# Altium project Carte_OPB.PrjPcb
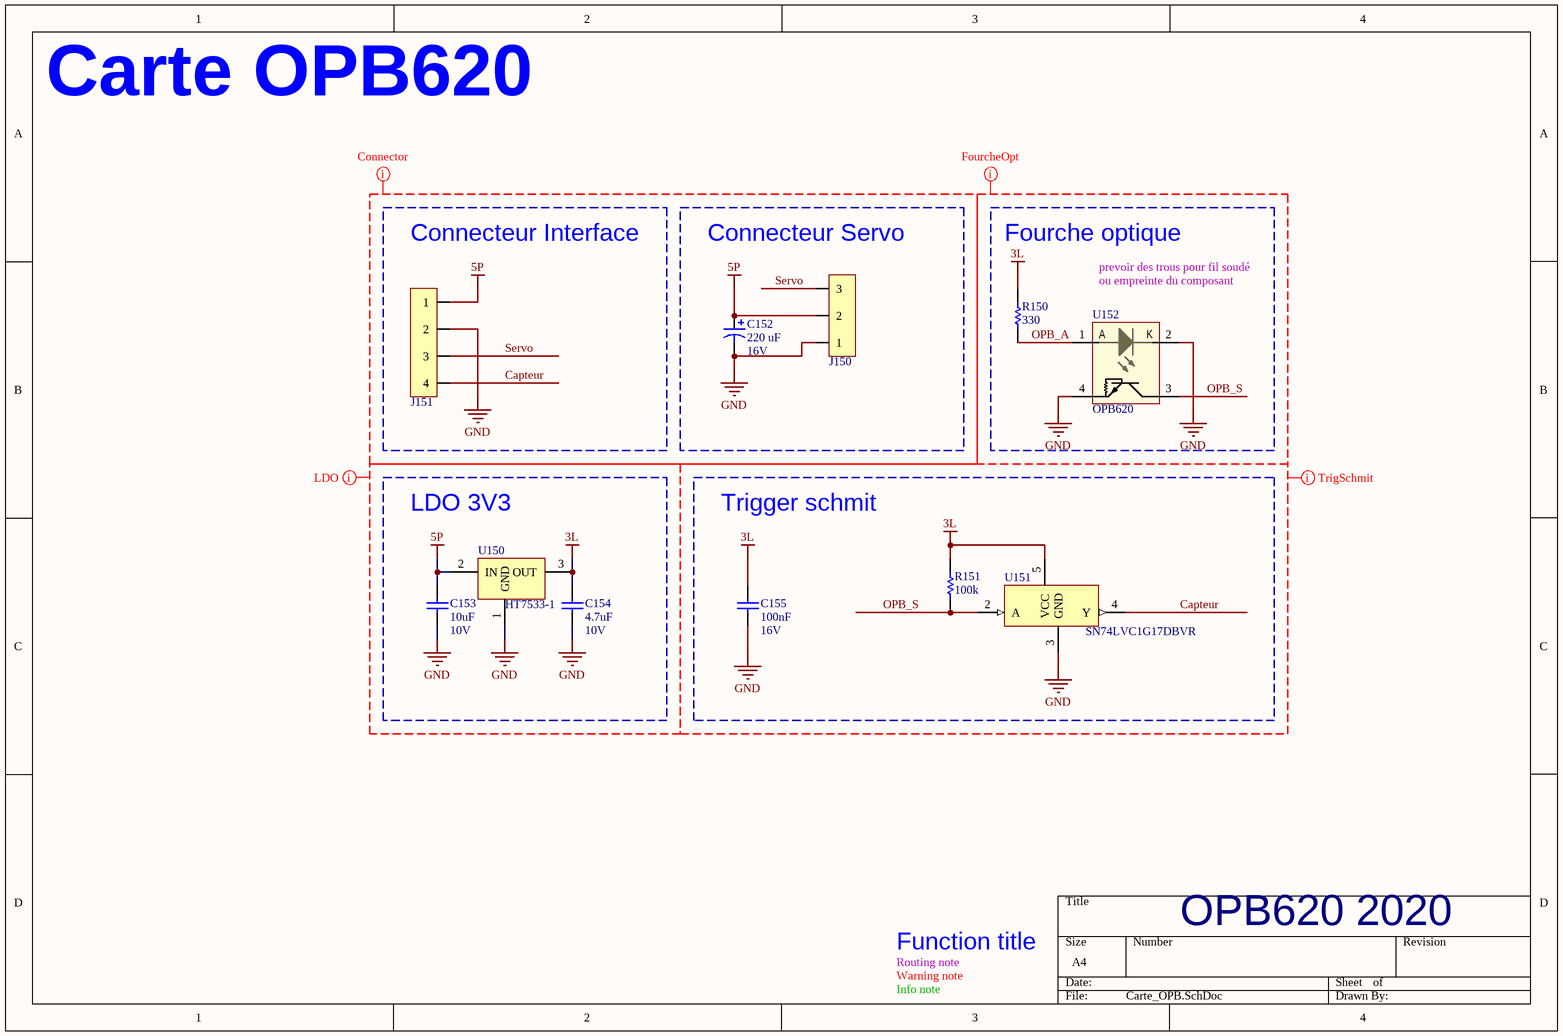
[diagram p0: Carte_OPB.SchDoc]
1 sheet, 11 parts. Net scope: global (net labels, ports and power ports of the same name join across sheets).
Board file: Carte_OPB-4L.PcbDoc

## Sheet Carte_OPB.SchDoc
size A4; Author: Audran; CompanyName: Goldorak; Address1: Electrolab; Address2: 52 rue Paul Lescop; Address3: 92000 Nanterre; DocumentNumber: 1; SheetNumber: 1; SheetTotal: 5; ProjectName: Cartes_2017

### Parts
C152  220 uF  RatedVoltage: 16V  [WCAP-ATG8_6.3x11x2.5x0.5]
C153  10uF  RatedVoltage: 10V  [WCAP-CSGP_0805, 2x1.25x1.25]
C154  4.7uF  RatedVoltage: 10V  [WCAP-CSGP_0603, 1.6x0.8x0.8]
C155  100nF  RatedVoltage: 16V  [WCAP-CSGP_0402, 1x0.5x0.5]
J150  22-03-2031  [22-03-2031]  (value not drawn)
J151  22-03-2041  [22-03-2041]  (value not drawn)
R150  value 330  [RESC1005X04N]  (hidden comment: RC0402FR-07330RL)
R151  value 100k  [RESC1005X04N]  (hidden comment: RC0402FR-07100KL)
U150  HT7533-1  [SOT89-150P350X160-3N]
U151  SN74LVC1G17DBVR  [SOT23_95P280X145-5N]
U152  OPB620  [OPB620]

### Blocks framed on the sheet
Connecteur Interface: J151
Connecteur Servo: C152 J150
Fourche optique: R150 U152
LDO 3V3: C153 C154 U150
Trigger schmit: C155 R151 U151

### Nets
3L: C154.1 C155.1 R150.1 R151.2 U150.3(OUT) U151.5(VCC)
5P: C152.1 C153.1 J150.2 J151.1 U150.2(IN)
GND: C152.2 C153.2 C154.2 C155.2 J150.1 J151.2 U150.1(GND) U151.3(GND) U152.2(LED_K) U152.4(NPN_E)
Capteur: J151.4 U151.4(Y)
OPB_A: R150.2 U152.1(LED_A)
OPB_S: R151.1 U151.2(A) U152.3(NPN_C)
Servo: J150.3 J151.3

Not connected (* = marked no-connect by the designer): U151 1(NC)

### Layout directives
net class FourcheOpt: 3L, GND, OPB_A, OPB_S
net class Connector: 5P, Capteur, GND, Servo
net class LDO: 3L, 5P, GND
net class TrigSchmit: 3L, Capteur, GND, OPB_S

### Notes on the sheet
- Carte OPB620
- prevoir des trous pour fil soudé
- ou empreinte du composant
- Routing note
- Warning note
- Function title
- OPB620 2020
- Info note
- (in symbol OPB620) A; K

### Library data of the parts
C152 = WCAP-ATG8, 860010373010: CAP Alu 220 UF 20% 16 V; Manufacturer: Wurth Elektronik; ComponentLink1Description: Datasheet; ComponentLink1URL: http://katalog.we-online.de/pbs/datasheet/860010373010.pdf; Manufacturer Part Number: 860010373010; Value: 220 uF; Size: 6.3mmx11mm
C153 = WCAP-CSGP, 885012207026: CAP CER 10uF 10V X7R 0805; Manufacturer: Wurth Elektronik; ComponentLink1Description: Datasheet; ComponentLink1URL: http://katalog.we-online.com/pbs/datasheet/885012207026.pdf; Value: 10uF; Size: 0805; CeramicType: X7R; Manufacturer Part Number: 885012207026; Supplier 2: JLCPCB; Supplier Part Number 2: C15850; Supplier 1: Farnell; Supplier Part Number 1: 2495189; Supplier Footprint 2: 0805
C154 = WCAP-CSGP, 885012106012: CAP CER 4.7UF 10V X5R 0603; Manufacturer: Wurth Elektronik; ComponentLink1Description: Datasheet; ComponentLink1URL: http://katalog.we-online.com/pbs/datasheet/885012106012.pdf; Value: 4.7uF; Size: 0603; CeramicType: X5R; Manufacturer Part Number: 885012106012; Supplier 2: JLCPCB; Supplier Part Number 2: C19666; Supplier Footprint 2: 0603
C155 = WCAP-CSGP, 885012205037: CAP CER 100nF 16V X7R 0402; Manufacturer: Wurth Elektronik; ComponentLink1Description: Datasheet; ComponentLink1URL: http://katalog.we-online.com/pbs/datasheet/885012205037.pdf; Value: 100nF; Size: 0402; CeramicType: X7R; Manufacturer Part Number: 885012205037; Supplier 2: JLCPCB; Supplier Part Number 2: C1525; Supplier Footprint 2: 0402
J150 = 22-03-2031: CONN HEADER VERT 3POS 2.54MM; Manufacturer: MOLEX; Supplier 1: Farnell; Supplier Part Number 1: 9731083; Manufacturer Part Number: 22-03-2031; ComponentLink1URL: http://www.farnell.com/datasheets/1785732.pdf; ComponentLink1Description: Datasheet; ComponentLink2URL: http://www.farnell.com/cad/495071.pdf  http://www.farnell.com/cad/1533907.pdf  http://www.farnell.com/cad/1533907.pdf; ComponentLink2Description: Drawings
J151 = 22-03-2041: CONN HEADER VERT 4POS 2.54MM; Manufacturer: MOLEX; Manufacturer Part Number: 22-03-2041; Supplier 1: Farnell; Supplier Part Number 1: 9731091; ComponentLink1Description: Datasheet; ComponentLink1URL: https://www.molex.com/pdm_docs/sd/022032041_sd.pdf
R150 = RC0402FR-07330RL: RES SMD 330 OHM 1% 1/16W 0402; Manufacturer: Yageo; Power: 63mW; Vmax: 50V; Type: Thick Film; ComponentLink1Description: Manufacturer; ComponentLink1URL: http://www.yageo.com/NewPortal/_en/index.jsp; ComponentLink2Description: Datasheet; ComponentLink2URL: http://www.farnell.com/datasheets/2167052.pdf; Manufacturer Part Number: RC0402FR-07330RL; Supplier 1: Farnell; Supplier Part Number 1: 9239170; Precision: ±1%; Supplier 2: JLCPCB; Supplier Part Number 2: C25104; Supplier Footprint 2: 0402
R151 = RC0402FR-07100KL: RES SMD 100K OHM 1% 1/16W 0402; Manufacturer: Yageo; Power: 63mW; Vmax: 50V; Type: Thick Film; ComponentLink1Description: Manufacturer; ComponentLink1URL: http://www.yageo.com/NewPortal/_en/index.jsp; ComponentLink2Description: Datasheet; ComponentLink2URL: http://www.farnell.com/datasheets/2167052.pdf; Manufacturer Part Number: RC0402FR-07100KL; Supplier 1: Farnell; Supplier Part Number 1: 9239472; Precision: ±1%; Supplier 2: JLCPCB; Supplier Part Number 2: C25741; Supplier Footprint 2: 0402
U150 = HT7533-1: LDO 3.3V 100mA SOT89; Manufacturer: Holtek; Manufacturer Part Number: HT7533-1; ComponentLink1URL: https://datasheet.lcsc.com/szlcsc/1812071811_Holtek-Semicon-HT7533-1_C14289.pdf; ComponentLink1Description: Datasheet; ComponentLink2Description: Manufacturer; ComponentLink2URL: https://www.holtek.com/productdetail/-/vg/75xx_1; Type: LDO; Value: 3.3V; Supplier 1: RSComponents; Supplier Part Number 1: 8850721; Supplier 2: JLCPCB; Supplier Part Number 2: C14289; Supplier Footprint 2: SOT-89-3
U151 = SN74LVC1G17DBVR: IC BUF NON-INVERT 5.5V SOT23-5; Manufacturer: TEXAS INSTRUMENTS; ComponentLink1URL: https://www.ti.com/lit/ds/symlink/sn74lvc1g17.pdf?ts=1590614797325; ComponentLink1Description: Datasheet; Manufacturer Part Number: SN74LVC1G17DBVR; Supplier 1: Farnell; Supplier Part Number 1: 3119606
U152 = OPB620: SENSOR OPT SLOT TRANS W/RES PCB; Manufacturer: TT ELECTRONICS; Manufacturer Part Number: OPB620; ComponentLink1URL: http://www.farnell.com/datasheets/2702441.pdf; ComponentLink1Description: Datasheet; Supplier 1: Farnell; Supplier Part Number 1: 491330

## Assembly variants
PROD: not fitted J1 J2